# EAGLE schematic untitled (EAGLE 9.6.2)
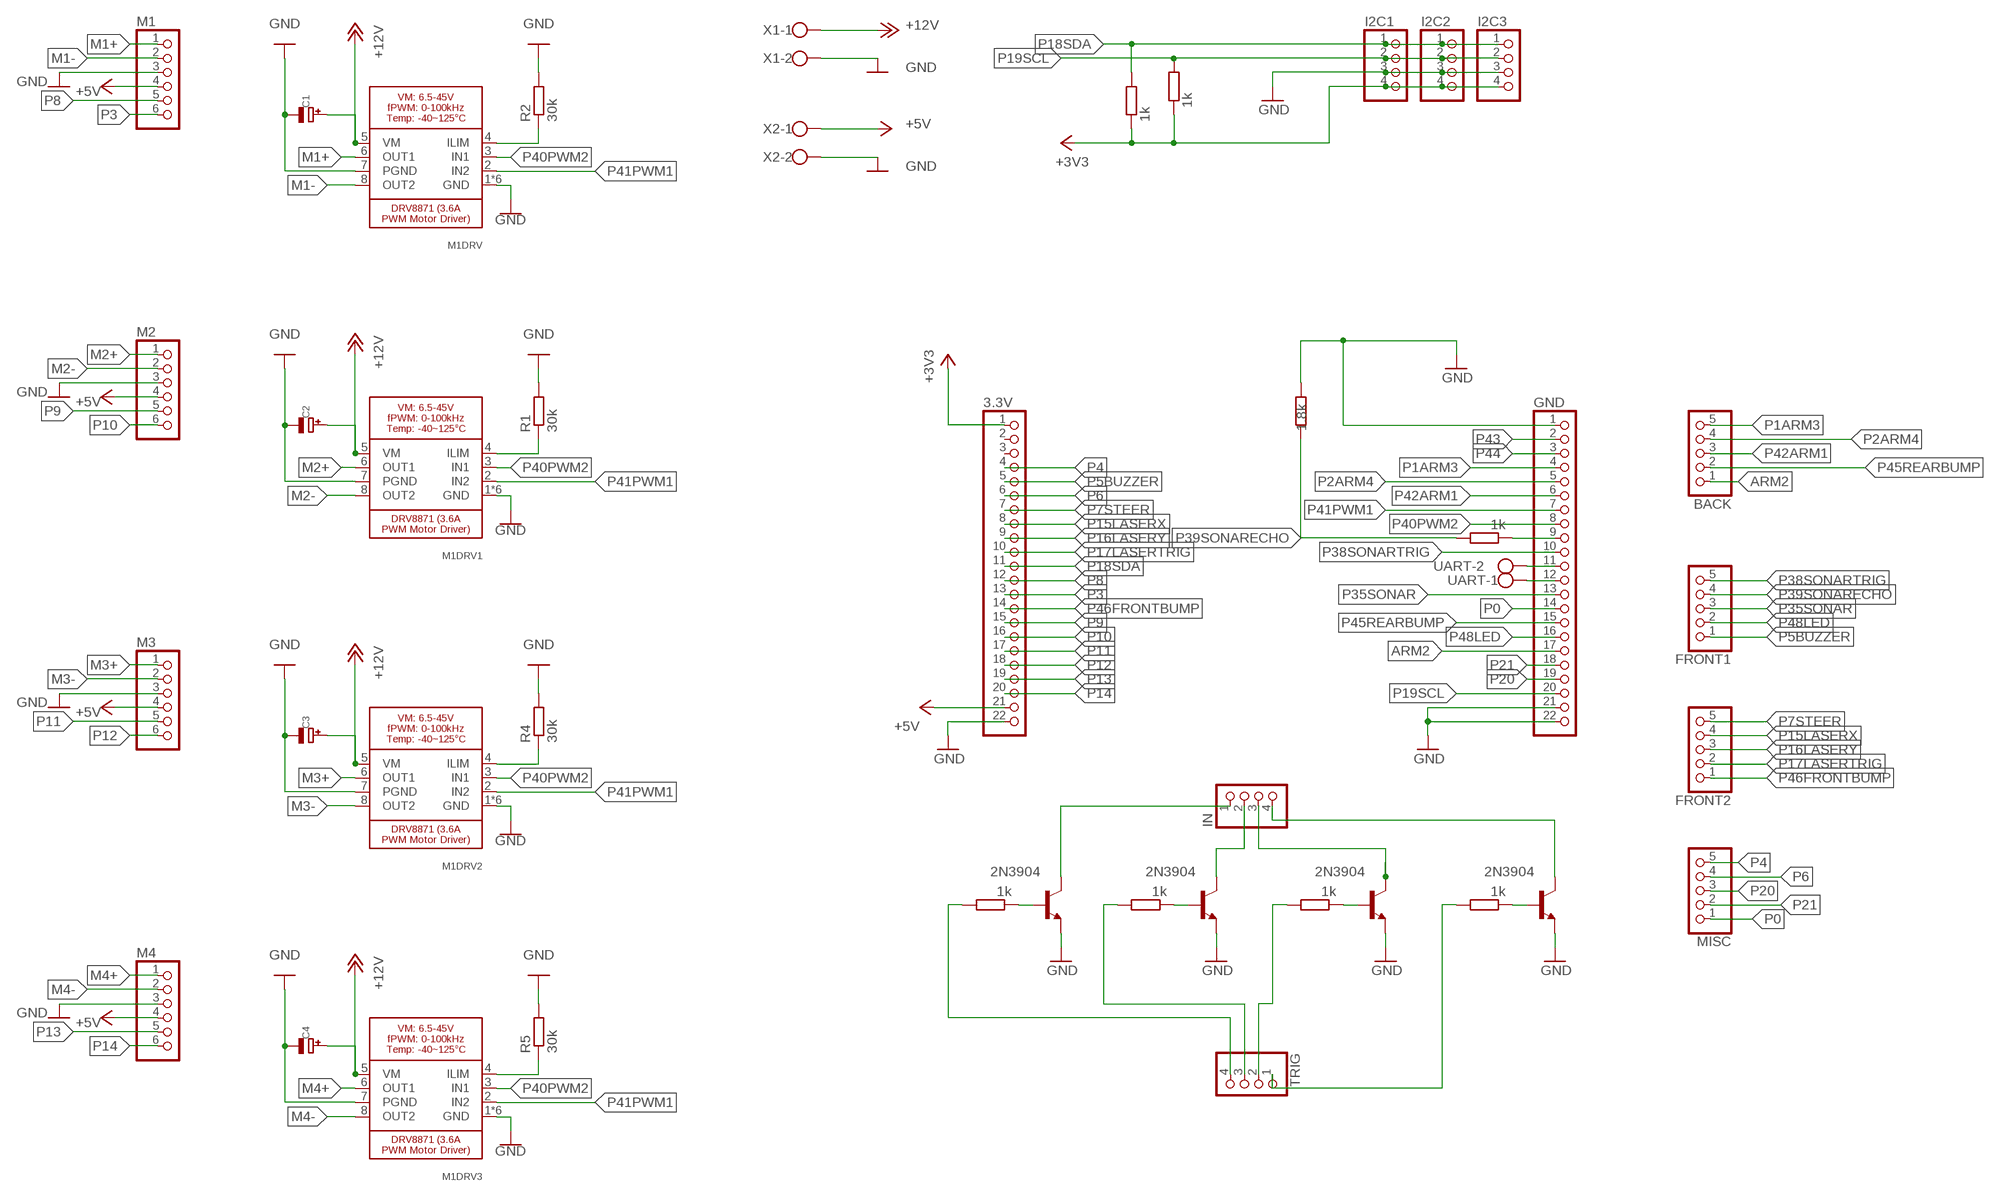
[diagram p0: schematic, sheet 1]

## Parts
1K  1k  R-EU_0207/10  [0207/10]
1K1  1k  R-EU_0207/10  [0207/10]
1K2  1.8k  R-EU_0207/10  [0207/10]
1K3  1k  R-EU_0207/10  [0207/10]
1K4  1k  R-EU_0207/10  [0207/10]
1K5  1k  R-EU_0207/10  [0207/10]
1K6  1k  R-EU_0207/10  [0207/10]
3.3V  PINHD-1X22  [1X22]
BACK  PINHD-1X5  [1X05]
C1  MICROBUILDER_CAP_ELECTROLYTICPTH_3.5MMGRID_10MMDIA  [MICROBUILDER_CELEC_3.5MM_10MM]
C2  MICROBUILDER_CAP_ELECTROLYTICPTH_3.5MMGRID_10MMDIA  [MICROBUILDER_CELEC_3.5MM_10MM]
C3  MICROBUILDER_CAP_ELECTROLYTICPTH_3.5MMGRID_10MMDIA  [MICROBUILDER_CELEC_3.5MM_10MM]
C4  MICROBUILDER_CAP_ELECTROLYTICPTH_3.5MMGRID_10MMDIA  [MICROBUILDER_CELEC_3.5MM_10MM]
FRONT1  PINHD-1X5  [1X05]
FRONT2  PINHD-1X5  [1X05]
GND  PINHD-1X22  [1X22]
I2C1  PINHD-1X4  [1X04]
I2C2  PINHD-1X4  [1X04]
I2C3  PINHD-1X4  [1X04]
IN  PINHD-1X4  [1X04]
M1  PINHD-1X6  [1X06]
M1DRV  MICROBUILDER_DRV8871  [MICROBUILDER_HSOP8]
M1DRV1  MICROBUILDER_DRV8871  [MICROBUILDER_HSOP8]
M1DRV2  MICROBUILDER_DRV8871  [MICROBUILDER_HSOP8]
M1DRV3  MICROBUILDER_DRV8871  [MICROBUILDER_HSOP8]
M2  PINHD-1X6  [1X06]
M3  PINHD-1X6  [1X06]
M4  PINHD-1X6  [1X06]
MISC  PINHD-1X5  [1X05]
R1  30k  R-EU_0207/10  [0207/10]
R2  30k  R-EU_0207/10  [0207/10]
R3  1k  R-EU_0207/10  [0207/10]
R4  30k  R-EU_0207/10  [0207/10]
R5  30k  R-EU_0207/10  [0207/10]
T1  2N3904  [TO92]
T2  2N3904  [TO92]
T3  2N3904  [TO92]
T4  2N3904  [TO92]
TRIG  PINHD-1X4  [1X04]
UART  W237-102  [W237-102]
X1  W237-102  [W237-102]
X2  W237-102  [W237-102]

## Nets
+3V3: 1K.1 3.3V.1 I2C1.4 I2C2.4 I2C3.4 R3.1
+5V: 3.3V.21 M1.4 M2.4 M3.4 M4.4 X2.1
+12V: C1.+ C2.+ C3.+ C4.+ M1DRV1.5(VM) M1DRV2.5(VM) M1DRV3.5(VM) M1DRV.5(VM) X1.1
ARM2: BACK.1 GND.17
GND: 1K2.1 3.3V.22 C1.- C2.- C3.- C4.- GND.1 GND.21 GND.22 I2C1.3 I2C2.3 I2C3.3 M1.3 M1DRV1.1(GND) M1DRV1.7(PGND) M1DRV1.GND M1DRV1.P$1(GND) M1DRV1.P$2(GND) M1DRV1.P$3(GND) M1DRV1.P$4(GND) M1DRV2.1(GND) M1DRV2.7(PGND) M1DRV2.GND M1DRV2.P$1(GND) M1DRV2.P$2(GND) M1DRV2.P$3(GND) M1DRV2.P$4(GND) M1DRV3.1(GND) M1DRV3.7(PGND) M1DRV3.GND M1DRV3.P$1(GND) M1DRV3.P$2(GND) M1DRV3.P$3(GND) M1DRV3.P$4(GND) M1DRV.1(GND) M1DRV.7(PGND) M1DRV.GND M1DRV.P$1(GND) M1DRV.P$2(GND) M1DRV.P$3(GND) M1DRV.P$4(GND) M2.3 M3.3 M4.3 R1.2 R2.2 R4.2 R5.2 T1.3(E) T2.3(E) T3.3(E) T4.3(E) X1.2 X2.2
IN: IN.1 T4.1(C)
M1+: M1.1 M1DRV.6(OUT1)
M1-: M1.2 M1DRV.8(OUT2)
M2+: M1DRV1.6(OUT1) M2.1
M2-: M1DRV1.8(OUT2) M2.2
M3+: M1DRV2.6(OUT1) M3.1
M3-: M1DRV2.8(OUT2) M3.2
M4+: M1DRV3.6(OUT1) M4.1
M4-: M1DRV3.8(OUT2) M4.2
N$1: M1DRV1.4(ILIM) R1.1
N$2: M1DRV2.4(ILIM) R4.1
N$3: 1K1.1 GND.9
N$4: M1DRV3.4(ILIM) R5.1
N$5: GND.11 UART.2
N$6: GND.12 UART.1
N$7: IN.2 T1.1(C)
N$8: 1K3.1 T1.2(B)
N$9: M1DRV.4(ILIM) R2.1
N$10: 1K3.2 TRIG.3
N$11: IN.3 T2.1(C)
N$12: 1K4.1 T2.2(B)
N$13: 1K4.2 TRIG.2
N$14: IN.4 T3.1(C)
N$15: 1K5.1 T3.2(B)
N$16: 1K5.2 TRIG.1
N$18: 1K6.1 T4.2(B)
N$19: 1K6.2 TRIG.4
P0: GND.14 MISC.1
P1ARM3: BACK.5 GND.4
P2ARM4: BACK.4 GND.5
P3: 3.3V.13 M1.6
P4: 3.3V.4 MISC.5
P5BUZZER: 3.3V.5 FRONT1.1
P6: 3.3V.6 MISC.4
P7STEER: 3.3V.7 FRONT2.5
P8: 3.3V.12 M1.5
P9: 3.3V.15 M2.5
P10: 3.3V.16 M2.6
P11: 3.3V.17 M3.5
P12: 3.3V.18 M3.6
P13: 3.3V.19 M4.5
P14: 3.3V.20 M4.6
P15LASERX: 3.3V.8 FRONT2.4
P16LASERY: 3.3V.9 FRONT2.3
P17LASERTRIG: 3.3V.10 FRONT2.2
P18SDA: 1K.2 3.3V.11 I2C1.1 I2C2.1 I2C3.1
P19SCL: GND.20 I2C1.2 I2C2.2 I2C3.2 R3.2
P20: GND.19 MISC.3
P21: GND.18 MISC.2
P35SONAR: FRONT1.3 GND.13
P38SONARTRIG: FRONT1.5 GND.10
P39SONARECHO: 1K1.2 1K2.2 FRONT1.4
P40PWM2: GND.8 M1DRV1.3(IN1) M1DRV2.3(IN1) M1DRV3.3(IN1) M1DRV.3(IN1)
P41PWM1: GND.7 M1DRV1.2(IN2) M1DRV2.2(IN2) M1DRV3.2(IN2) M1DRV.2(IN2)
P42ARM1: BACK.3 GND.6
P43: GND.2
P44: GND.3
P45REARBUMP: BACK.2 GND.15
P46FRONTBUMP: 3.3V.14 FRONT2.1
P48LED: FRONT1.2 GND.16
Unconnected: 3.3V.2 3.3V.3

## Library data of the parts
1K 1K1-1K6 R1-R5 = rcl:R-EU_: RESISTOR, European symbol; SPICEPREFIX: R
3.3V GND = pinhead:PINHD-1X22: PIN HEADER
BACK FRONT1 FRONT2 MISC = pinhead:PINHD-1X5: PIN HEADER
C1-C4 = Adafruit DRV8871:MICROBUILDER_CAP_ELECTROLYTIC: Electrolytic Capacitors SMT PANASONIC_C - Size C Panasonic Electrolytic Aluminum Capacitor 47µF 16V 20% Electrolytic Capacitor [Digikey: PCE3890TR-ND] PANASONIC_D - Size D Panasonic Electrolytic Aluminum Capacitor 100µF 25V 20% Electrolytic Capacitor [Digikey: PCE3898TR-ND] PTH 3.5 mm grid, 8 mm diameter ... 3.5 mm grid, 10 mm diameter ...
I2C1-I2C3 IN TRIG = pinhead:PINHD-1X4: PIN HEADER
M1-M4 = pinhead:PINHD-1X6: PIN HEADER
M1DRV M1DRV1-M1DRV3 = Adafruit DRV8871:MICROBUILDER_DRV8871: DRV8871 - 3.6A PWM Motor Driver
T1-T4 = transistor:2N3904: NPN TRANSISTOR
UART X1 X2 = con-wago-500:W237-102: WAGO SCREW CLAMP; MPN: 237-102; OC_FARNELL: unknown; OC_NEWARK: 70K9898

## Net classes
0 default: clearance 0.205 mm